# EasyEDA schematic SCH_beushed-esc_2025-11-09.json
TITLE: brushed esc; REV: 2.0; Date: 2025-10-17; Sheet: 1/1; Drawn By: maker.adithya; Company: Nukelabs
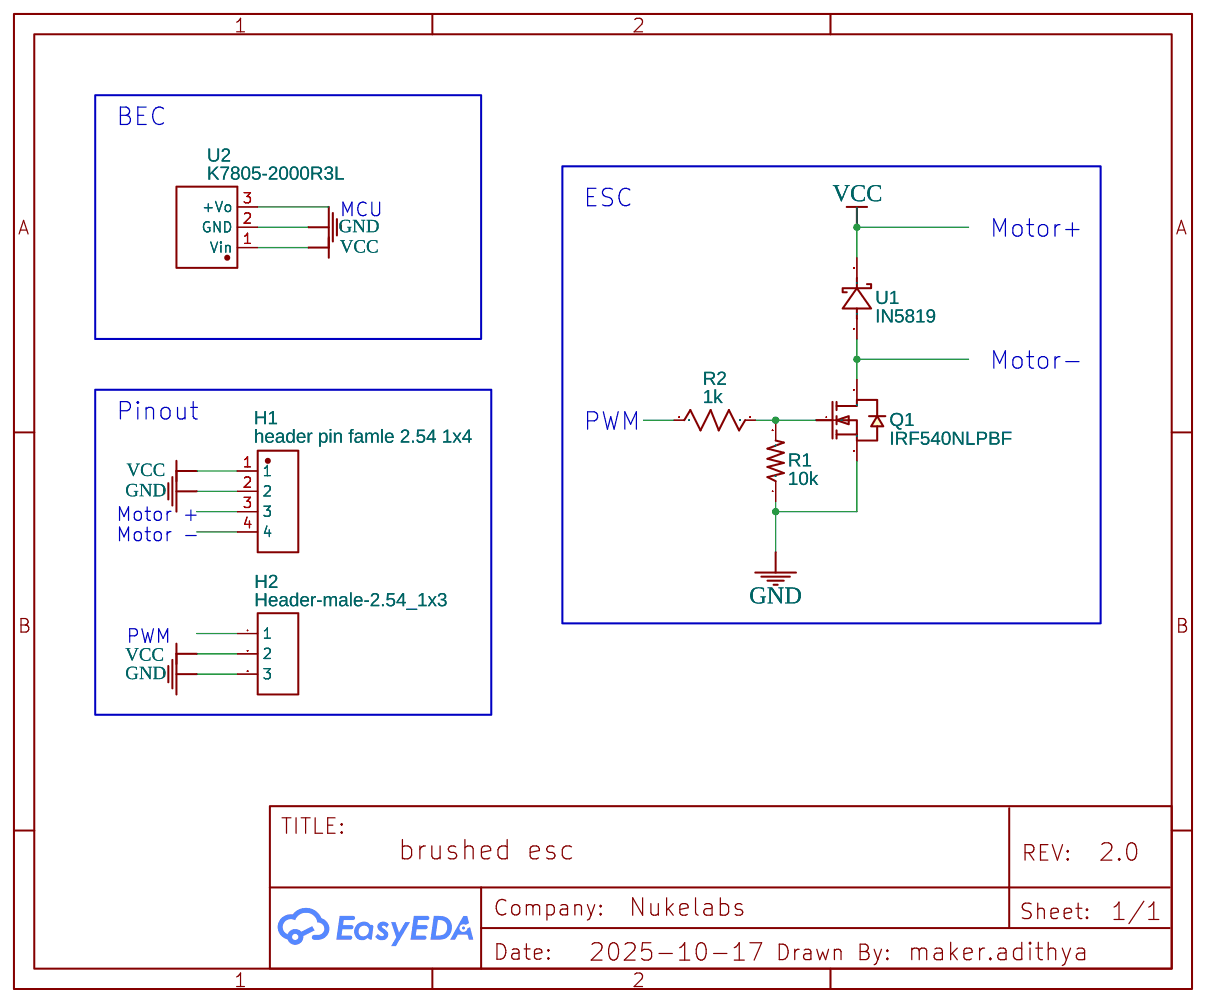
[diagram p0: schematic sheet]

## Parts
H1  header pin famle 2.54 1x4  [HDR-F-2.54_1X4]
H2  Header-male-2.54_1x3  [HDR-TH_3P-P2.54-V-F]
Q1  IRF540NLPBF  [IRF540N]
R1  10k  [MY RESISITOR_1/4_WATT]
R2  1k  [MY RESISITOR_1/4_WATT]
U1  IN5819  [DO-41_BD2.4-L4.7-P8.70-D0.8-FD]
U2  K7805-2000R3L  [TO-220_L7805CV]

## Library data of the parts
H1 = HX PH254-01-04-Z-L11.5 STRAIGHT PIN HEADER: Supplier: LCSC; Supplier Part: C52016392; Manufacturer: hanxia(韩下); Manufacturer Part: HX PH254-01-04-Z-L11.5 straight pin header; JLCPCB Part Class: Extended Part; Contributor: lcsc
H2 = Header-Female-2.54_1x3: Supplier Part: C146243; Supplier: LCSC; Manufacturer: BOOMELE(博穆精密); Manufacturer Part: 2.54-1*3P母; JLCPCB Part Class: Extended Part
Q1 = IRF540NLPBF: Contributor: lcsc; Supplier: LCSC; Supplier Part: C459969; Manufacturer: Infineon(英飞凌); JLCPCB Part Class: Extended Part; Package Display: No
R1 = RESISTOR copy: Contributor: SparkFun; Package Display: No
R2 = R_0603_US: Contributor: LCEDA_Lib
U1 = IN5819: Contributor: LCSC; Supplier: LCSC; Supplier Part: C9900005587; Manufacturer: null; JLCPCB Part Class: Extended Part
U2 = K7805-2000R3L: Supplier: LCSC; Supplier Part: C2911676; Manufacturer: MORNSUN(金升阳); JLCPCB Part Class: Extended Part; Contributor: lcsc

## Nets
GND: H1.2 H2.3 Q1.3(S) R1.1 U2.2(GND)
VCC: H1.1 H2.2 U1.2(K) U2.1(Vin)
Net-(Q1-1): Q1.1(G) R1.2 R2.2
Net-(Q1-2): Q1.2(D) U1.1(A)

Not connected (* = marked no-connect by the designer): H1 3 4; H2 1; R2 1; U2 3(+Vo)

## Notes on the sheet
- BEC
- ESC
- MCU
- Motor+
- Motor-
- Pinout
- PWM
- Motor +
- Motor -
- PWM
